# EAGLE schematic Charging Shutdown Circuit Schematic (EAGLE 9.6.2)
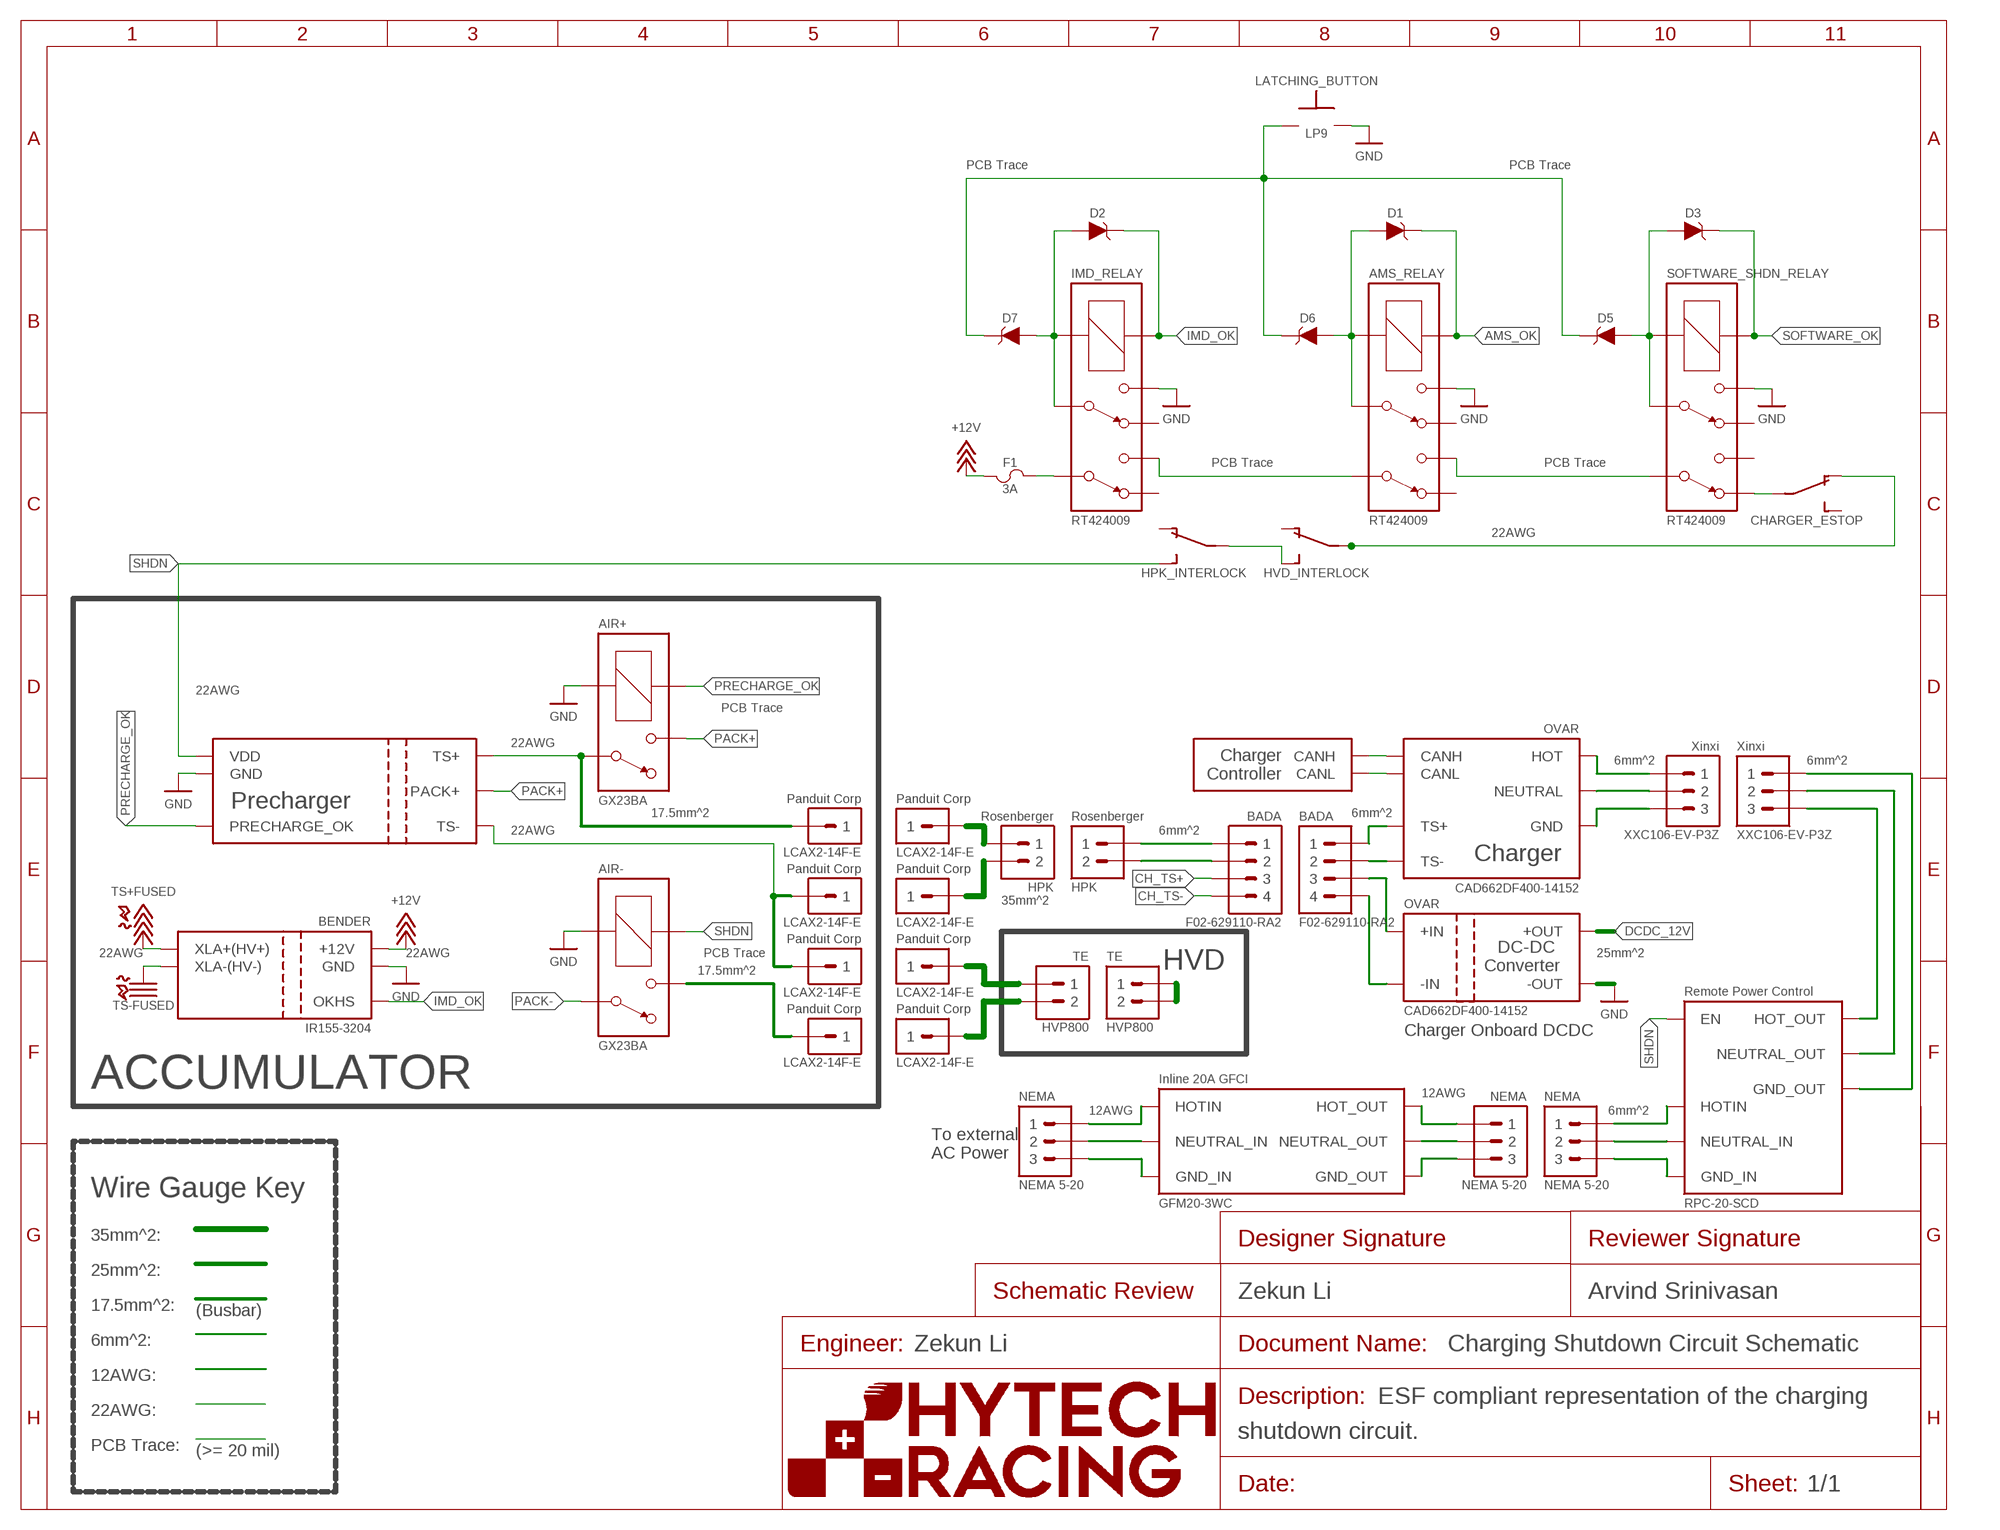
[diagram p0: schematic, sheet 1]
U$10 (FRAME_SCHEMATIC_ONLY): DESCRIPTION_1: ESF compliant representation of the charging; DESCRIPTION_2: shutdown circuit.; DESIGNER_SCHEMATIC: Zekun Li; ENGINEER: Zekun Li; REVIEWER_SCHEMATIC: Arvind Srinivasan

## Parts
A1  INLINE_GFCI_GFM20-3WC  (no package)
A2  REMOTE_POWER_CONTROL_RPC-20-SCD  (no package)
A3  CHARGER_CAD662DF400-14152  (no package)
AIR+  RELAY_SPST_NO_GX23BA  (no package)
AIR-  RELAY_SPST_NO_GX23BA  (no package)
AMS_RELAY  RELAY_DPDT_RT424009  (no package)
D1  DIODE  (no package)
D2  DIODE  (no package)
D3  DIODE  (no package)
D5  DIODE  (no package)
D6  DIODE  (no package)
D7  DIODE  (no package)
F1  3A  FUSE  (no package)
IMD_RELAY  RELAY_DPDT_RT424009  (no package)
J1  CONNECTOR-2_HPK  (no package)
J2  CONNECTOR-2_HPK  (no package)
J3  CONNECTOR-1_LCAX2-14F-E  (no package)
J4  CONNECTOR-1_LCAX2-14F-E  (no package)
J5  CONNECTOR-1_LCAX2-14F-E  (no package)
J6  CONNECTOR-1_LCAX2-14F-E  (no package)
J7  CONNECTOR-3_NEMA-5-20  (no package)
J8  CONNECTOR-3_XXC106-EV-P3Z  (no package)
J9  CONNECTOR-3_XXC106-EV-P3Z  (no package)
J10  CONNECTOR-1_LCAX2-14F-E  (no package)
J11  CONNECTOR-1_LCAX2-14F-E  (no package)
J12  CONNECTOR-1_LCAX2-14F-E  (no package)
J13  CONNECTOR-1_LCAX2-14F-E  (no package)
J14  CONNECTOR-3_NEMA-5-20  (no package)
J15  CONNECTOR-3_NEMA-5-20  (no package)
J16  CONNECTOR-4_F02-629110-RA2  (no package)
J17  CONNECTOR-4_F02-629110-RA2  (no package)
J18  CONNECTOR-2_HVP800  (no package)
J19  CONNECTOR-2_HVP800  (no package)
LATCHING_BUTTON  BUTTON_NO_LP9  (no package)
S1  SWITCH_SPST_  (no package)
S2  SWITCH_SPST_  (no package)
S3  SWITCH_SPST_  (no package)
SOFTWARE_SHDN_RELAY  RELAY_DPDT_RT424009  (no package)
U$1  DC-DC_CONVERTER_CAD662DF400-14152  (no package)
U$7  PRECHARGER  (no package)
U$11  CHARGER_CONTROLLER  (no package)
U$12  BENDER_IR155-3204  (no package)

## Nets
+12V: F1.1 U$12.+12V
AMS_OK: AMS_RELAY.COIL+ D1.C
CH_TS+: J17.3
CH_TS-: J17.4
CHARGER_CONTROLLER_CANH: A3.CANH U$11.CANH
CHARGER_CONTROLLER_CANL: A3.CANL U$11.CANL
DCDC_12V: U$1.+OUT
GND: AIR+.COIL+ AIR-.COIL+ AMS_RELAY.4 IMD_RELAY.4 LATCHING_BUTTON.P$2 SOFTWARE_SHDN_RELAY.4 U$1.-OUT U$7.GND U$12.GND
HVD+: J10.1 J19.1
HVD-: J11.1 J19.2
IMD_OK: D2.C IMD_RELAY.COIL+ U$12.OKHS
N$1: D2.A D7.A IMD_RELAY.3 IMD_RELAY.COIL-
N$2: D5.C D6.C D7.C LATCHING_BUTTON.P$1
N$3: AMS_RELAY.3 AMS_RELAY.COIL- D1.A D6.A
N$4: S2.S S3.P
N$5: D3.A D5.A SOFTWARE_SHDN_RELAY.3 SOFTWARE_SHDN_RELAY.COIL-
N$6: F1.2 IMD_RELAY.6
N$7: S1.P SOFTWARE_SHDN_RELAY.7
N$8: S1.O S2.P
N$10: AMS_RELAY.5 SOFTWARE_SHDN_RELAY.6
N$11: AMS_RELAY.6 IMD_RELAY.5
N$12: AIR+.CONTACT1 J6.1 U$7.TS+
N$13: J5.1 J13.1 U$7.TS-
N$14: AIR-.CONTACT2 J12.1
N$15: A2.HOT_OUT J9.3
N$16: J2.1 J17.1
N$17: J2.2 J17.2
N$18: J1.1 J3.1
N$19: J1.2 J4.1
N$20: A3.HOT J8.1
N$21: A3.NEUTRAL J8.2
N$22: A3.GND J8.3
N$23: A2.HOTIN J7.1
N$24: A2.NEUTRAL_IN J7.2
N$25: A2.GND_IN J7.3
N$26: A1.HOT_OUT J14.1
N$31: A1.NEUTRAL_OUT J14.2
N$32: A2.NEUTRAL_OUT J9.2
N$33: A2.GND_OUT J9.1
N$34: A1.GND_OUT J14.3
N$35: A1.GND_IN J15.3
N$36: A1.NEUTRAL_IN J15.2
N$37: A1.HOTIN J15.1
N$39: A3.TS+ J16.1
N$40: A3.TS- J16.2
N$41: J18.1 J18.2
N$42: J16.4 U$1.-IN
N$43: J16.3 U$1.+IN
PACK+: AIR+.CONTACT2 U$7.PACK+
PACK-: AIR-.CONTACT1
PRECHARGE_OK: AIR+.COIL- U$7.PRECHARGE_OK
SHDN: A2.EN AIR-.COIL- S3.S U$7.VDD
SOFTWARE_OK: D3.C SOFTWARE_SHDN_RELAY.COIL+
TS+: U$12.XLA+(HV+) ; supply symbol labelled TS+FUSED
TS-UNFUSED: U$12.XLA-(HV-) ; supply symbol labelled TS-FUSED
Unconnected: AMS_RELAY.2 AMS_RELAY.7 IMD_RELAY.2 IMD_RELAY.7 S1.S S2.O S3.O SOFTWARE_SHDN_RELAY.2 SOFTWARE_SHDN_RELAY.5

## Notes on the sheet
- PCB Trace | PCB Trace
- PCB Trace | PCB Trace
- 22AWG
- 22AWG
- PCB Trace
- 22AWG
- 6mm^2 | 6mm^2
- 17.5mm^2 | 6mm^2
- 22AWG | 6mm^2
- 35mm^2
- 22AWG | 22AWG | PCB Trace | HVD | 25mm^2
- 17.5mm^2
- Charger Onboard DCDC
- ACCUMULATOR | 12AWG
- 12AWG | 6mm^2
- To external
  AC Power
- Wire Gauge Key
- 35mm^2:
- 25mm^2:
- 17.5mm^2:
- (Busbar)
- 6mm^2:
- 12AWG:
- 22AWG:
- PCB Trace:
- (>= 20 mil)

## Library data of the parts
A1 = HyTechSymbolsTemp:INLINE_GFCI_*: Inline GFCI GFM20-3WC <https://www.leviton.com/en/docs/Portable_GFCI_Devices_PB_Q-315E.pdf>; MANFUACTURER: Leviton; MPN: GFM20-3WC
A2 = HyTechSymbolsTemp:REMOTE_POWER_CONTROL_*: Remote power control RPC-20-SCD <https://www.lowellmfg.com/wp-content/uploads/1230-RPC20SCD.pdf>; MANUFACTURER: Lowell Manufacturing; MPN: RPC-20-SCD
A3 = HyTechSymbolsTemp:CHARGER_*; MANUFACTURER: OVAR; MPN: CAD662DF400-14152
AIR+ AIR- = HyTechSymbolsTemp:RELAY_SPST_NO_?*: Single pole single throw normally open relay 3350-1275-126 <https://drive.google.com/file/d/1L0NeZqCX2TFaVQbwFxpbbu9uMJSPuulv/view> GX23BA <https://drive.google.com/file/d/1Ccq0vir690jgHxUhztItQKfgtS51YNj_/view>; MANUFACTURER: Gigavac; MPN: GX23BA
AMS_RELAY IMD_RELAY SOFTWARE_SHDN_RELAY = HyTechSymbolsTemp:RELAY_DPDT_?*: Dual pole dual throw relay RT424009 <https://drive.google.com/file/d/12KcB2gZ1-F85lC-w8KP3F9yHGxVaqaUc/view>; MANUFACTURER: TE Connectivity Potter & Brumfield Relays; MPN: RT424009
D1-D3 D5-D7 = HyTechSymbolsTemp:DIODE
F1 = HyTechSymbolsTemp:FUSE
J1 J2 = HyTechSymbolsTemp:CONNECTOR-2_*: Two pin connector EVH2-N2TK-TDA <https://drive.google.com/file/d/1gQfuywpa-Tm7bohh-tcSjjxbyqcnD_h9/view> HPK <https://drive.google.com/file/d/1jTQMZ26zoHotHQHZYMoMT2jUzRt664sO/view> HVP800 <https://drive.google.com/file/d/1j-HswfqYHj8usJ9E3bf8NWBzB-X0BKJ4/view>; MANUFACTURER: Rosenberger; MPN: HPK
J3-J6 J10-J13 = HyTechSymbolsTemp:CONNECTOR-1_*: Single pin connector CT2242-2 <https://drive.google.com/file/d/1rFz1F44pFGMLks1TuzNftb-wQBk0xWUD/view> LCAX2-14F-E <https://drive.google.com/file/d/1bbvHAAOUtBwm4fAPUWES_iBsARNVuAgN/view>; MANUFACTURER: Panduit Corp; MPN: LCAX2-14F-E
J7 J14 J15 = HyTechSymbolsTemp:CONNECTOR-3_*: Three pin connector XXC106-EV-P3Z <https://drive.google.com/file/d/1qR1Rhcju7C1tSf9gvk0xHmD0lfie2p2O/view?usp=sharing> HV02-M3S(40A)-M00A-1 <https://drive.google.com/file/d/14-0BdluqhzWVuxobIuHQclYd8S9S8AFy/view> NEMA-5-20 <https://drive.google.com/file/d/1QyRJhkZq4Jge6F64jD-5aG-LjfEdAoZD/view>; MANUFACTURER: NEMA; MPN: NEMA 5-20
J8 J9 = HyTechSymbolsTemp:CONNECTOR-3_*: Three pin connector XXC106-EV-P3Z <https://drive.google.com/file/d/1qR1Rhcju7C1tSf9gvk0xHmD0lfie2p2O/view?usp=sharing> HV02-M3S(40A)-M00A-1 <https://drive.google.com/file/d/14-0BdluqhzWVuxobIuHQclYd8S9S8AFy/view> NEMA-5-20 <https://drive.google.com/file/d/1QyRJhkZq4Jge6F64jD-5aG-LjfEdAoZD/view>; MANUFACTURER: Xinxi; MPN: XXC106-EV-P3Z
J16 J17 = HyTechSymbolsTemp:CONNECTOR-4_*: Four pin connector Micro-Fit 3.0 <https://drive.google.com/file/d/1Be8WGxzm3IeOWSN4qfSP8J4bwHUWCwaO/view>; MANUFACTURER: BADA; MPN: F02-629110-RA2
J18 J19 = HyTechSymbolsTemp:CONNECTOR-2_*: Two pin connector EVH2-N2TK-TDA <https://drive.google.com/file/d/1gQfuywpa-Tm7bohh-tcSjjxbyqcnD_h9/view> HPK <https://drive.google.com/file/d/1jTQMZ26zoHotHQHZYMoMT2jUzRt664sO/view> HVP800 <https://drive.google.com/file/d/1j-HswfqYHj8usJ9E3bf8NWBzB-X0BKJ4/view>; MANUFACTURER: TE; MPN: HVP800
LATCHING_BUTTON = HyTechSymbolsTemp:BUTTON_NO_*: Normally open pushbutton OTTO P9 Series Pushbutton Switches <https://www.mouser.com/datasheet/2/603/P9_Sealed_Dome_Pushbuttons_Catalog_Pages-2576938.pdf> OTTO LP9 Series Illuminated Pushbutton Switches <https://www.otto-controls.com/-/media/products/electromechanical-switches/pushbuttonswitches/lp9illuminatedsealedmomentaryactionpushbuttonswitch/LP9-Pushbuttons-Catalog-Pages.ashx>; MANUFACTURER: OTTO; MPN: LP9
S1 = HyTechSymbols:SWITCH_SPST_*: Single Pull Single Throw Switch EAO Series 45 40mm Illuminated Emergency Stop Swtich <https://hmi.eao.com/p/965f6719> EAO Series 45 34mm Illuminated Emergency Stop Switch <https://hmi.eao.com/p/5909b34f>; MPN: CHARGER_ESTOP
S2 = HyTechSymbols:SWITCH_SPST_*: Single Pull Single Throw Switch EAO Series 45 40mm Illuminated Emergency Stop Swtich <https://hmi.eao.com/p/965f6719> EAO Series 45 34mm Illuminated Emergency Stop Switch <https://hmi.eao.com/p/5909b34f>; MPN: HVD_INTERLOCK
S3 = HyTechSymbols:SWITCH_SPST_*: Single Pull Single Throw Switch EAO Series 45 40mm Illuminated Emergency Stop Swtich <https://hmi.eao.com/p/965f6719> EAO Series 45 34mm Illuminated Emergency Stop Switch <https://hmi.eao.com/p/5909b34f>; MPN: HPK_INTERLOCK
U$1 = HyTechSymbols:DC-DC_CONVERTER_*: DC_DC Converter Vicor DCM Series <https://www.mouser.com/datasheet/2/685/DCM4623xD2J13D0y7z_ds-1144763.pdf>; MANUFACTURER: OVAR; MPN: CAD662DF400-14152
U$7 = HyTechSymbolsTemp:PRECHARGER: Block representation of the HT06 precharger.
U$11 = HyTechSymbolsTemp:CHARGER_CONTROLLER: Block representation of the charger controller.
U$12 = HyTechSymbols:BENDER_IR155-3204: Bender IR155-3204 Insulation Monitoring Device Datasheet <http://www.bender-es.com/fileadmin/products/doc/IR155-32xx-V004_D00115_D_XXEN.pdf>